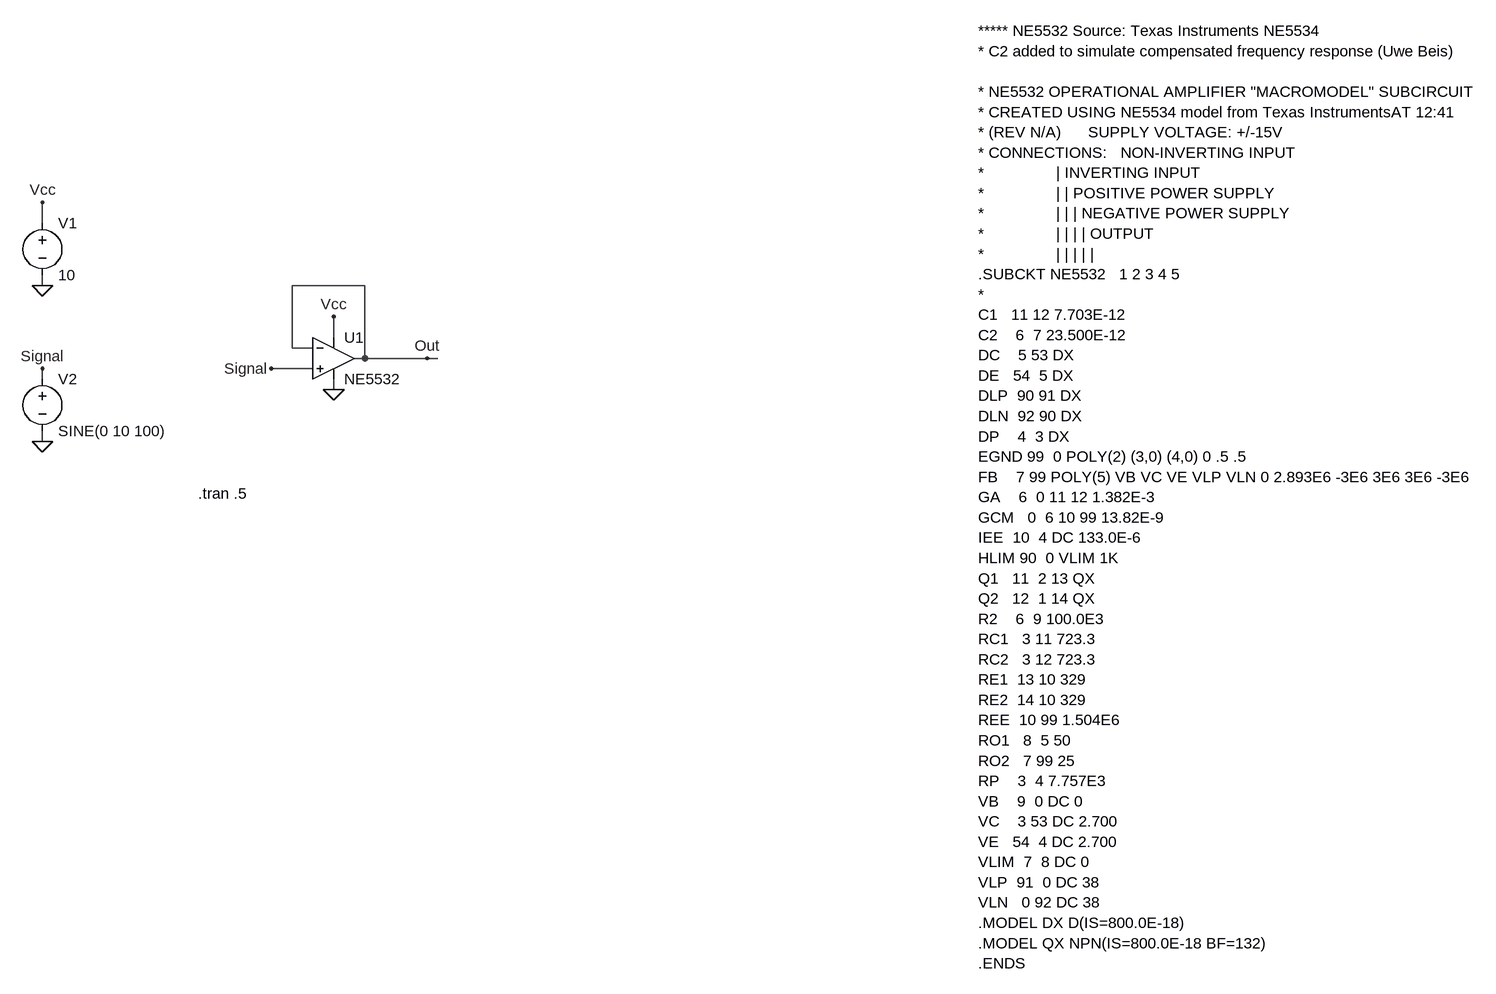
[diagram p0: schematic VoltageFollower.asc]
VoltageFollower.asc, the LTspice schematic file:
Version 4
SHEET 1 1140 1360
WIRE -1120 352 -1120 320
WIRE -1120 448 -1120 432
WIRE -624 448 -736 448
WIRE -672 528 -672 496
WIRE -736 544 -736 448
WIRE -704 544 -736 544
WIRE -624 560 -624 448
WIRE -624 560 -640 560
WIRE -528 560 -624 560
WIRE -512 560 -528 560
WIRE -704 576 -768 576
WIRE -1120 592 -1120 576
WIRE -672 608 -672 592
WIRE -1120 688 -1120 672
FLAG -672 608 0
FLAG -1120 688 0
FLAG -1120 448 0
FLAG -1120 320 Vcc
FLAG -672 496 Vcc
FLAG -1120 576 Signal
FLAG -528 560 Out
FLAG -768 576 Signal
SYMBOL OpAmps\\opamp2 -672 496 R0
SYMATTR InstName U1
SYMATTR Value NE5532
SYMBOL voltage -1120 336 R0
WINDOW 123 0 0 Left 0
WINDOW 39 0 0 Left 0
SYMATTR InstName V1
SYMATTR Value 10
SYMBOL voltage -1120 576 R0
WINDOW 123 0 0 Left 0
WINDOW 39 0 0 Left 0
SYMATTR InstName V2
SYMATTR Value SINE(0 10 100)
TEXT 320 56 Left 2 !***** NE5532 Source: Texas Instruments NE5534\n* C2 added to simulate compensated frequency response (Uwe Beis)\n \n* NE5532 OPERATIONAL AMPLIFIER "MACROMODEL" SUBCIRCUIT\n* CREATED USING NE5534 model from Texas InstrumentsAT 12:41\n* (REV N/A)      SUPPLY VOLTAGE: +/-15V\n* CONNECTIONS:   NON-INVERTING INPUT\n*                | INVERTING INPUT\n*                | | POSITIVE POWER SUPPLY\n*                | | | NEGATIVE POWER SUPPLY\n*                | | | | OUTPUT\n*                | | | | |\n.SUBCKT NE5532   1 2 3 4 5\n*\nC1   11 12 7.703E-12\nC2    6  7 23.500E-12\nDC    5 53 DX\nDE   54  5 DX\nDLP  90 91 DX\nDLN  92 90 DX\nDP    4  3 DX\nEGND 99  0 POLY(2) (3,0) (4,0) 0 .5 .5\nFB    7 99 POLY(5) VB VC VE VLP VLN 0 2.893E6 -3E6 3E6 3E6 -3E6\nGA    6  0 11 12 1.382E-3\nGCM   0  6 10 99 13.82E-9\nIEE  10  4 DC 133.0E-6\nHLIM 90  0 VLIM 1K\nQ1   11  2 13 QX\nQ2   12  1 14 QX\nR2    6  9 100.0E3\nRC1   3 11 723.3\nRC2   3 12 723.3\nRE1  13 10 329\nRE2  14 10 329\nREE  10 99 1.504E6\nRO1   8  5 50\nRO2   7 99 25\nRP    3  4 7.757E3\nVB    9  0 DC 0\nVC    3 53 DC 2.700\nVE   54  4 DC 2.700\nVLIM  7  8 DC 0\nVLP  91  0 DC 38\nVLN   0 92 DC 38\n.MODEL DX D(IS=800.0E-18)\n.MODEL QX NPN(IS=800.0E-18 BF=132)\n.ENDS
TEXT -880 768 Left 2 !.tran .5

The netlist it stands for:
* VoltageFollower.asc
XU1 Signal Out Vcc 0 Out NE5532  ; pins In+ In- V+ V- OUT
V1 Vcc 0 10
V2 Signal 0 SINE(0 10 100)
***** NE5532 Source: Texas Instruments NE5534
* C2 added to simulate compensated frequency response (Uwe Beis)
* NE5532 OPERATIONAL AMPLIFIER "MACROMODEL" SUBCIRCUIT
* CREATED USING NE5534 model from Texas InstrumentsAT 12:41
* (REV N/A)      SUPPLY VOLTAGE: +/-15V
* CONNECTIONS:   NON-INVERTING INPUT
*                | INVERTING INPUT
*                | | POSITIVE POWER SUPPLY
*                | | | NEGATIVE POWER SUPPLY
*                | | | | OUTPUT
*                | | | | |
.SUBCKT NE5532   1 2 3 4 5
*
C1   11 12 7.703E-12
C2    6  7 23.500E-12
DC    5 53 DX
DE   54  5 DX
DLP  90 91 DX
DLN  92 90 DX
DP    4  3 DX
EGND 99  0 POLY(2) (3,0) (4,0) 0 .5 .5
FB    7 99 POLY(5) VB VC VE VLP VLN 0 2.893E6 -3E6 3E6 3E6 -3E6
GA    6  0 11 12 1.382E-3
GCM   0  6 10 99 13.82E-9
IEE  10  4 DC 133.0E-6
HLIM 90  0 VLIM 1K
Q1   11  2 13 QX
Q2   12  1 14 QX
R2    6  9 100.0E3
RC1   3 11 723.3
RC2   3 12 723.3
RE1  13 10 329
RE2  14 10 329
REE  10 99 1.504E6
RO1   8  5 50
RO2   7 99 25
RP    3  4 7.757E3
VB    9  0 DC 0
VC    3 53 DC 2.700
VE   54  4 DC 2.700
VLIM  7  8 DC 0
VLP  91  0 DC 38
VLN   0 92 DC 38
.MODEL DX D(IS=800.0E-18)
.MODEL QX NPN(IS=800.0E-18 BF=132)
.ENDS
.tran .5
.backanno
.end